# EAGLE design Wand Battery Board Rev 1 (EAGLE 9.7.0)
Assembly variants: AA-Batteries
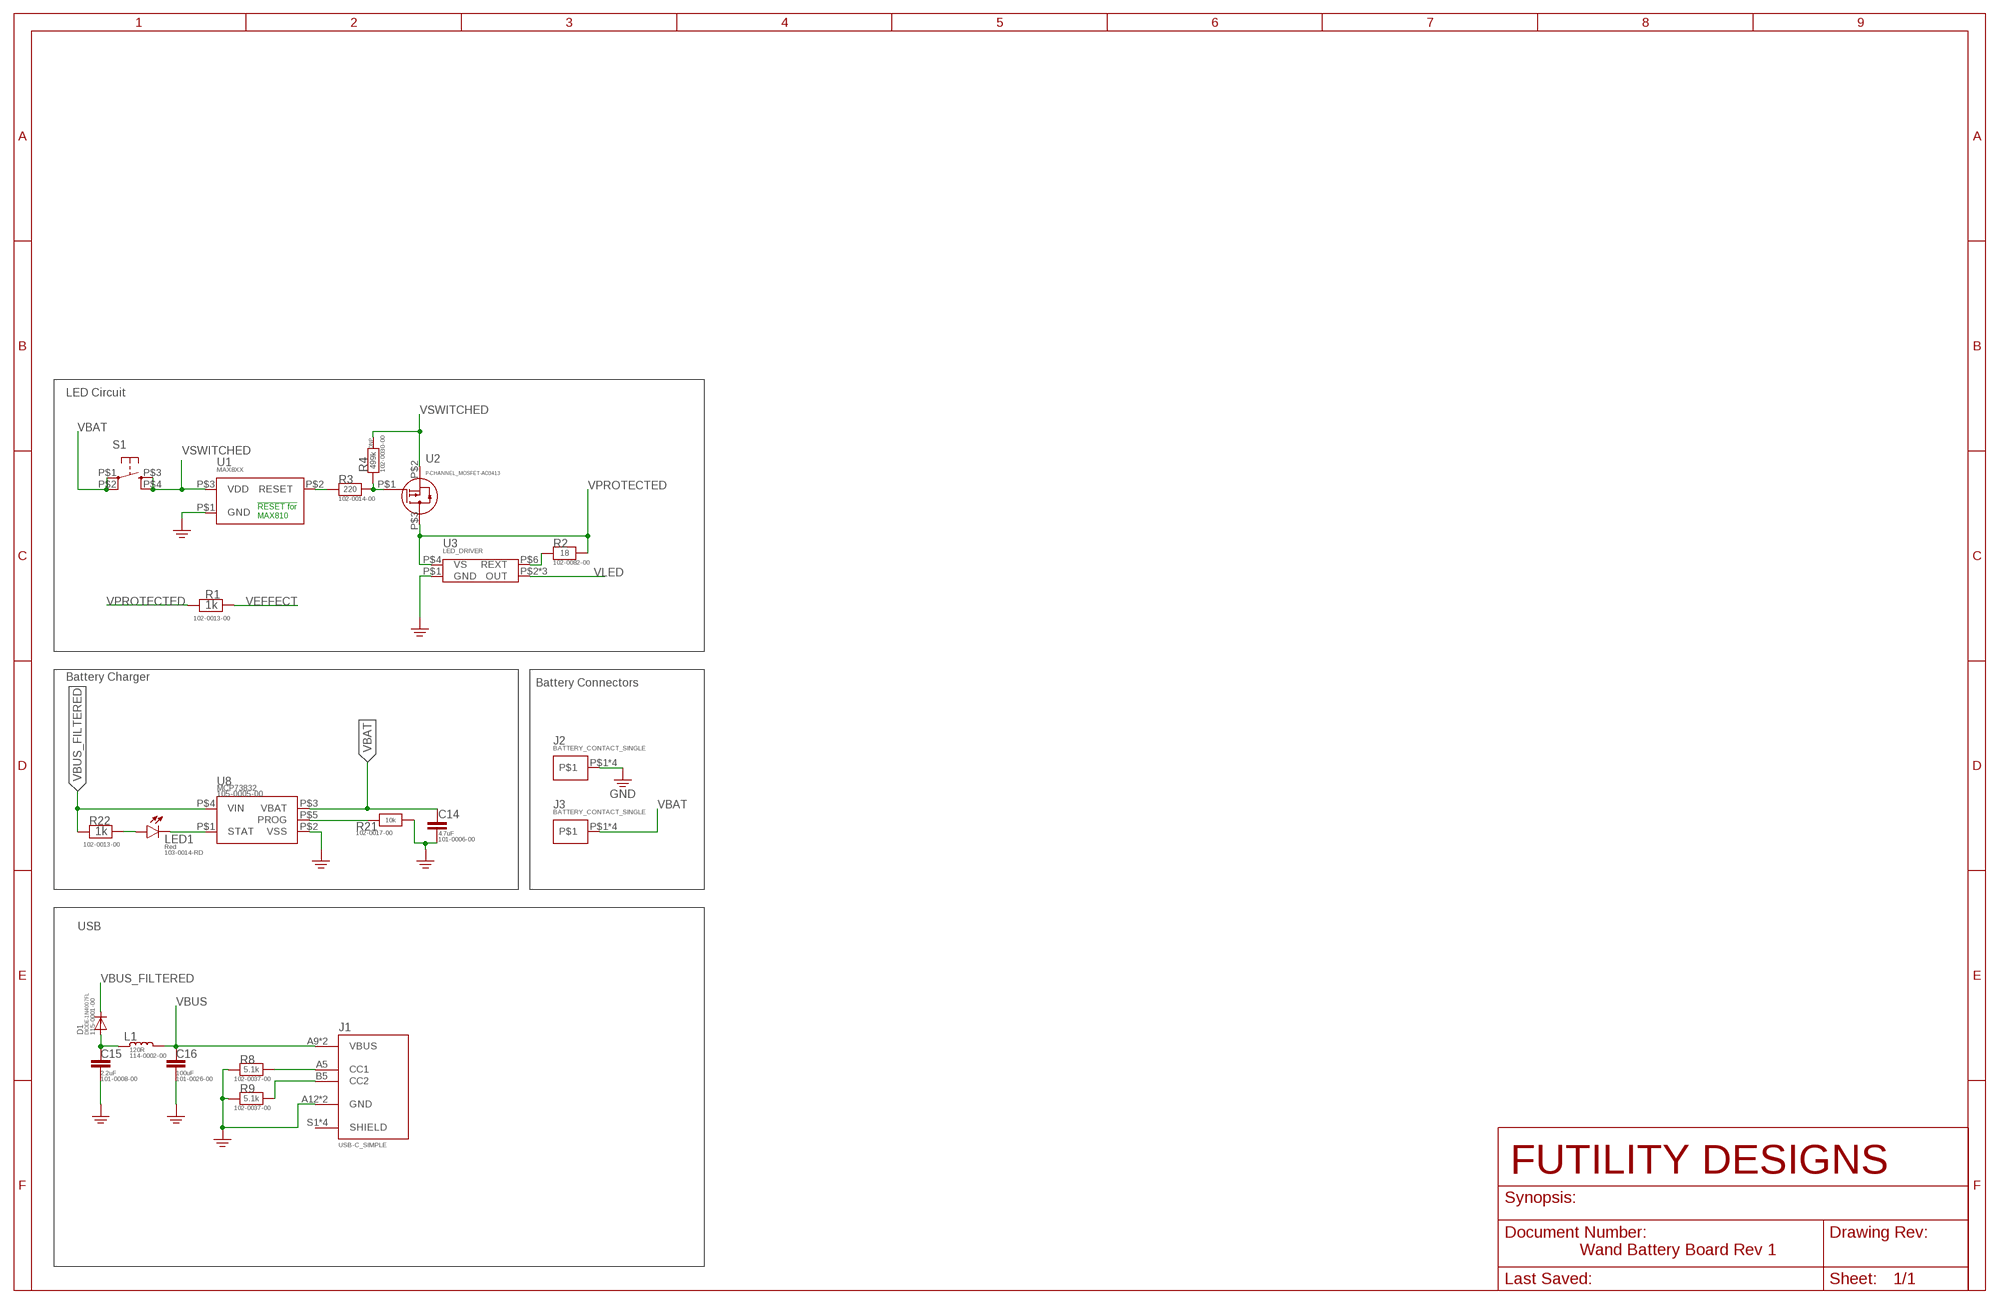
[diagram p0: schematic, sheet 1]

## Parts
C14  4.7uF  CAPACITOR-SMD-0402  [0402]
C15  2.2uF  CAPACITOR-SMD-0603  [0603]
C16  100uF  CAPACITOR-SMD-1210  [1210]
D1  DIODE-1N4007FL  [SOD-123FL]
J1  USB-C_SIMPLE  [GCT_USB4125-GF-A_REVA2]
J2  BATTERY_CONTACT_SINGLE  [BH-129A-5]
J3  BATTERY_CONTACT_SINGLE  [BH-129A-5]
L1  120R  INDUCTOR0603  [0603]
LED1  Red  LED-RA_0603  [IN-S63AS]
R1  1k  RESISTOR-SMD0402  [0402]
R2  18  RESISTOR-SMD0402  [0402]
R3  220  RESISTOR-SMD0402  [0402]
R4  499k  RESISTOR-SMD0402  [0402]
R8  5.1k  RESISTOR-SMD0402  [0402]
R9  5.1k  RESISTOR-SMD0402  [0402]
R21  10k  RESISTOR-SMD0402  [0402]
R22  1k  RESISTOR-SMD0402  [0402]
S1  BUTTON_MOM-6X6X4.3SMD  [6X6X4.3_SMD]
U1  MAX8XX  [SOT23]
U2  P-CHANNEL_MOSFET-AO3413  [SOT23]
U3  LED_DRIVER  [SOT26]
U8  MCP73832  [MCP73832]

## Nets
GND: C14.P$2 C15.P$2 C16.P$2 J1.A12(GND) J1.B12(GND) J2.P$1 J2.P$2 J2.P$3 J2.P$4 R8.P$2 R9.P$2 R21.P$2 U1.P$1(GND) U3.P$1(GND) U8.P$2(VSS)
N$1: J1.A5(CC1) R8.P$1
N$2: R2.P$1 U3.P$6(REXT)
N$3: R3.P$1 U1.P$2(RESET)
N$4: R3.P$2 R4.P$1 U2.P$1(G)
N$5: J1.B5(CC2) R9.P$1
N$10: C15.P$1 D1.P$2(ANODE) L1.P$1
N$16: LED1.P$1(C) U8.P$1(STAT)
N$18: LED1.P$2(A) R22.P$2
N$22: R21.P$1 U8.P$5(PROG)
VBAT: C14.P$1 J3.P$1 J3.P$2 J3.P$3 J3.P$4 S1.P$1(P) S1.P$2(P1) U8.P$3(VBAT)
VBUS: C16.P$1 J1.A9(VBUS) J1.B9(VBUS) L1.P$2
VBUS_FILTERED: D1.P$1(CATHODE) R22.P$1 U8.P$4(VIN)
VEFFECT: R1.P$2
VLED: U3.P$2(OUT) U3.P$3(OUT) U3.P$5(OUT)
VPROTECTED: R1.P$1 R2.P$2 U2.P$3(D) U3.P$4(VS)
VSWITCHED: R4.P$2 S1.P$3(S) S1.P$4(S1) U1.P$3(VDD) U2.P$2(S)
Unconnected: J1.S1(SHIELD) J1.S2(SHIELD) J1.S3(SHIELD) J1.S4(SHIELD)

## Notes on the sheet
- LED Circuit
- Battery Charger
- Battery Connectors
- USB

## Library data of the parts
C14 = 1-chris-parts:CAPACITOR-SMD; PART_NUMBER: 101-0006-00
C15 = 1-chris-parts:CAPACITOR-SMD; PART_NUMBER: 101-0008-00
C16 = 1-chris-parts:CAPACITOR-SMD; PART_NUMBER: 101-0026-00
D1 = 1-chris-parts:DIODE; PART_NUMBER: 115-0001-00
J1 = 1-chris-parts:USB-C_SIMPLE
J2 J3 = 1-Chris-Power:BATTERY_CONTACT_SINGLE
L1 = 1-chris-parts:INDUCTOR: Inductors 0603: 10nH Ceramic Inductor - microwire antenna/RF (Digikey: 712-1434-2-ND) 0805: 560nH Ceramic Inductor - RF (Digikey: 553-1047-1-ND) 270nH Ceramic Inductor - Q = 40@250MHz, +-5%, 1 Ohm DC Resistance (Digikey: 535-10506-2-ND) 1007 (2518 Metric) SMT: 10µH 10% 250mOhm 820mA 1007 Inductor (Digikey: 587-2189-1-ND) 22µH 10% 500mOhm 580mA 1007 Inductor (Digikey: 587-2190-1-ND) 47µH 10% 950mOhm 420mA 1007 Inductor (Digikey: 587-2191-1-ND) 47µH 5% 100mOhm 1A 1008 Inductor (Digikey: 732-1816-1-ND) 5.0x5.0mm (Taiyo Yuden NR5040 Series) 6.8µH 20% 2.3A 64mOhm Inductor (Digikey: 587-2374-2-ND) 5.0x5.0mm (TDK VLC5045 Series) 4.7µH 20% 3.3A 34mOhm Inductor (Digikey: 445-6526-1-ND) 6.8µH 20% 2.7A 46mOhm Inductor (Digikey: 445-6527-1-ND) 6.0x6.0mm (TDK VLC6045 Series) 4.7µH 20% 3.8A 27mOhm Inductor (Digikey: 445-6538-2-ND) 6.8µH 20% 3A 41mOhm Inductor (Digikey: 445-6540-1-ND) 6.2µH 30% 2.2A 45mOhm Inductor (Digikey: SRR5028-6R2YCT-ND) - Not TDK VLC6045 but footprint should match 6.0x6.0mm (TDK SLF6045 Series) 6.8uH 30% 2A 33mOhm Inductor (Digikey: 445-4572-1-ND, Mouser: 810-SLF645T6R8N2R0PF) 6.0x6.0mm (Sumida CDRH5D28 Series) 6.2uH 30% 1.8A 45mOhm Inductor (Digikey: 308-1542-1-ND) Taiyo Yuden NR3015T2R2M - 2.2uH 20% 1.5A (Digikey: 587-1648-2-ND, Mouser: 963-NR3015T2R2M) - Used with TI TPS62172 CoilCraft RFID Transponder Coil - MA5532-AE (For use with AS3935 Lightning Sensor) Vishay IHLP 1.0uH Molded Inductor - 24mOhm DCR, 5A, +/-20%, -55°C-125°C (Digikey: 541-1319-1-ND); PART_NUMBER: 114-0002-00
LED1 = 1-chris-parts:LED; PART_NUMBER: 103-0014-RD
R1 R22 = 1-chris-parts:RESISTOR-SMD; PART_NUMBER: 102-0013-00
R2 = 1-chris-parts:RESISTOR-SMD; PART_NUMBER: 102-0082-00
R3 = 1-chris-parts:RESISTOR-SMD; PART_NUMBER: 102-0014-00
R4 = 1-chris-parts:RESISTOR-SMD; DNP: yes; PART_NUMBER: 102-0030-00
R8 R9 = 1-chris-parts:RESISTOR-SMD; PART_NUMBER: 102-0037-00
R21 = 1-chris-parts:RESISTOR-SMD; PART_NUMBER: 102-0017-00
S1 = 1-chris-parts:BUTTON_MOM: OMRON SWITCH
U1 = 1-chris-parts:MAX8XX
U2 = 1-chris-parts:P-CHANNEL_MOSFET
U3 = 1-chris-parts:LED_DRIVER
U8 = 1-chris-parts:MCP73832; PART_NUMBER: 105-0005-00

## Net classes
1 diff pairs: width 0.152 mm

## Board
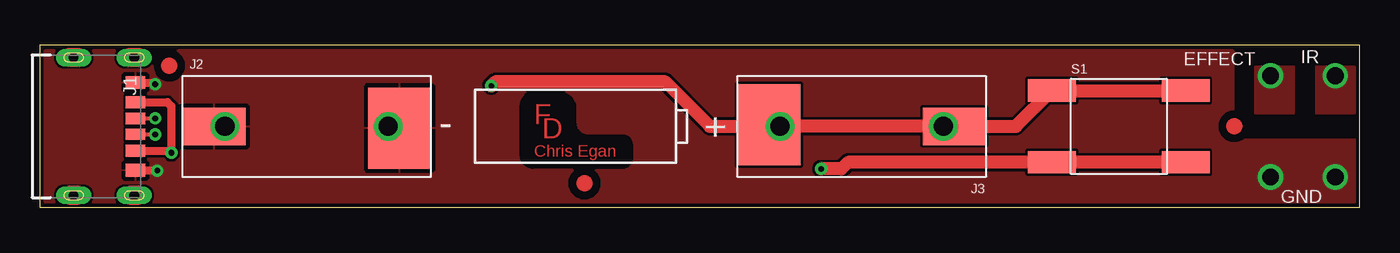
[diagram p1: board, top side]
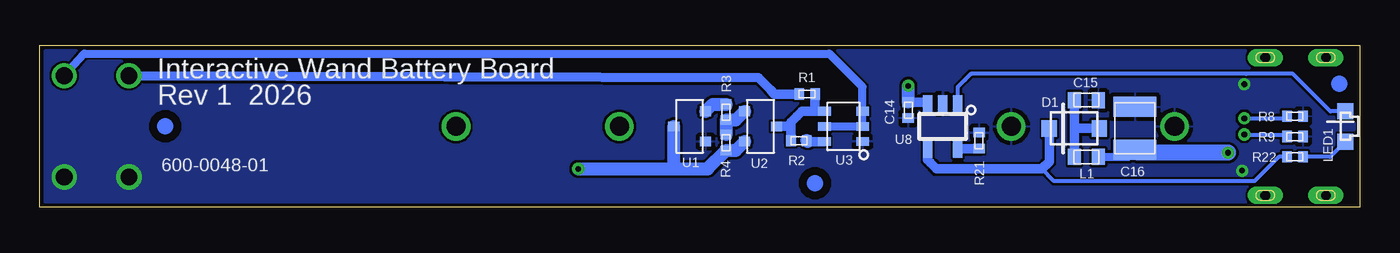
[diagram p2: board, bottom side, seen from below]

Size 82.8 x 10.16 mm. Coordinates in mm from the lower left corner, seen from the top.
Outline: 0,0 82.8,0 82.8,10.16 0,10.16 0,0
Copper layers (1*16): Top / Bottom
Stack-up Default Layer Stack: Top SilkScreen Epoxy Ink / Top SolderMask SR:Green 0.0254mm Dk 4.3 / Top Surface Finish Lead-Free 0.02mm / Top CuFoil:007 0.035mm / Dielectric-1 User Defined 0.9mm / Bottom CuFoil:007 0.035mm / Bottom Surface Finish Lead-Free 0.02mm / Bottom SolderMask SR:Green 0.0254mm Dk 4.3 / Bottom SilkScreen Epoxy Ink
Design rules: minimum copper width classes=1 6mil, minimum copper width 6mil, minimum drill size 0.35mm, copper clearance wire_polygon to wire_polygon 6mil, copper clearance wire_polygon to pad_smd 6mil, copper clearance wire_polygon to via 6mil, copper clearance pad_smd to pad_smd 6mil, copper clearance pad_smd to via 6mil, copper clearance via to via 6mil, copper clearance smd to pad (same net) 6mil, copper clearance smd to via (same net) 6mil, copper clearance smd to smd (same net) 6mil, dimension clearance 10mil, restrict clearance 0mil, via restrict clearance 0mil, drill distance 6mil, keepout clearance 0mil

### Footprints (pad centres in the part's own frame; a part is rotated, then mirrored left to right if it is on the bottom)
0402 = smd 0.7 x 0.6: P$1 0,0.5; P$2 0,-0.5
0603 = smd 1 x 0.8: P$1 0,0.75; P$2 0,-0.75
1210 = smd 2.7 x 1.25: P$1 0,1.35; P$2 0,-1.35
SOD-123FL = smd 0.95 x 1.05: P$1 -1.575,0; P$2 1.575,0
GCT_USB4125-GF-A_REVA2 = smd 0.7 x 1.2: A5 -0.5,3.08; B5 0.5,3.08 | smd 0.76 x 1.2: A9 1.52,3.08; B9 -1.52,3.08 | smd 0.8 x 1.2: A12 2.75,3.08; B12 -2.75,3.08 | drill 0.6 pad 0.8 long: S1 -4.32,3; S2 4.32,3; S3 -4.32,-0.8; S4 4.32,-0.8
BH-129A-5 = smd 3.96 x 2.34: P$1 -0.68,0 | smd 3.96 x 5.08: P$2 10.96,-0.1 | drill 1.2: P$3 0,0; P$4 10.25,0
IN-S63AS = smd 1 x 1: P$1 -0.95,0; P$2 0.95,0
6X6X4.3_SMD = smd 3 x 1.4: P$1 -4.2,2.25; P$2 4.2,2.25; P$3 -4.2,-2.25; P$4 4.2,-2.25
SOT23 = smd 0.6 x 0.7: P$1 -0.95,-1; P$2 0.95,-1; P$3 0,1
SOT26 = smd 0.55 x 0.8: P$1 -0.95,-1.2; P$2 0,-1.2; P$3 0.95,-1.2; P$4 0.95,1.2; P$5 0,1.2; P$6 -0.95,1.2
MCP73832 = smd 0.6 x 1.1: P$1 -0.95,-1.4; P$2 0,-1.4; P$3 0.95,-1.4; P$4 0.95,1.4; P$5 -0.95,1.4

### Placement (x,y rotation side)
C14  28.32,6.1 0 bottom
C15  17.14,6.73 90 bottom
C16  14.1,4.95 180 bottom
D1  17.91,4.95 0 bottom
J1  2.92,5.08 270 top
J2  11.61,5.08 0 top
J3  56.69,5.08 180 top
L1  17.14,3.17 90 bottom
LED1  0.89,5.08 270 bottom
R1  34.67,7.11 270 bottom
R2  35.18,4.19 270 bottom
R3  39.75,5.97 0 bottom
R4  39.75,4.06 0 bottom
R8  4.06,5.71 90 bottom
R9  4.06,4.45 90 bottom
R21  23.88,4.19 180 bottom
R22  4.06,3.17 90 bottom
S1  67.69,5.08 0 top
U1  42.04,5.08 90 bottom
U2  37.59,5.08 270 bottom
U3  32.38,5.08 90 bottom
U8  26.16,5.08 180 bottom
U$1  [FIDUCIAL]  74.93,5.08 0 top
U$2  [FIDUCIAL]  34.16,1.52 0 top
U$3  [FIDUCIAL]  8.13,8.89 0 top
U$4  [FIDUCIAL]  1.27,7.75 180 bottom
U$5  [FIDUCIAL]  34.16,1.52 180 bottom
U$6  [FIDUCIAL]  74.93,5.08 180 bottom
U$7  [LOGO_SMALLER]  30.99,3.17 0 top

### Tracks (layer width: path | path; a pad name or v marks a point on that pad's centre or on a via)
GND  (via drill 0.35, 1.05)
  Top 0.508: J1.A12 7.32,2.33 7.34,2.31 v7.37,2.31 | J1.B12 7.13,7.83 v7.24,7.72
  other vias: 77.22,1.91 81.28,1.91
  pour Top: 82.55,1.27 76.2,1.27 76.2,4.32 82.55,4.32
  pour Bottom (rank 2): -1.65,11.81 84.07,11.81 84.07,-1.4 -1.65,-1.4
  pour Top (rank 2): -2.03,12.19 74.93,12.19 74.93,4.32 83.31,4.32 83.31,-2.67 -2.16,-2.67
N$1  (via drill 0.35)
  Top 0.254: J1.A5 v7.24,5.59
  Bottom 0.254: v7.24,5.59 4.69,5.59 R8.P$1
N$2
  Bottom 0.61: 34.62,4.13 U3.P$6
  Bottom 0.813: R2.P$1 34.62,4.13
N$3
  Bottom 0.813: R3.P$1 40.6,6.47 U1.P$2
N$4
  Bottom 0.813: R4.P$1 R3.P$2 39.15,5.47 U2.P$1
N$5  (via drill 0.35)
  Top 0.254: J1.B5 v7.23,4.58 v7.24,4.57
  Bottom 0.254: v7.24,4.57 4.69,4.57 R9.P$1
N$10
  Bottom 0.61: L1.P$1 17.89,4.95 | 17.89,4.95 C15.P$1 | D1.P$2 17.89,4.95
N$16
  Bottom 0.254: U8.P$1 25.21,7.55 24.77,8 24.38,8.38 7.11,8.38 4.19,8.38 2.92,7.11 1.84,6.03 LED1.P$1
N$18
  Bottom 0.254: LED1.P$2 1.84,3.17 R22.P$2
N$22
  Bottom 0.61: U8.P$5 R21.P$1
VBAT  (via drill 0.35)
  Top 0.813: v28.32,7.62 28.57,7.87 39.24,7.87 42.04,5.08 45.63,5.08 J3.P$2 45.83,5.08 | 45.83,5.08 J3.P$4 | J3.P$1 J3.P$3 | J3.P$1 45.83,5.08 | J3.P$1 61.24,5.08 S1.P$1 S1.P$2
  Bottom 0.61: U8.P$3 27.23,6.6 C14.P$1
  Bottom 0.813: C14.P$1 v28.32,7.62
VBUS  (via drill 0.35)
  Top 0.508: J1.B9 8.01,6.6 8.26,6.35 v8.26,3.43 8.12,3.56 J1.A9
  Bottom 0.508: L1.P$2 14.53,3.17 C16.P$1
  Bottom 1.016: v8.26,3.43 13.92,3.43 C16.P$1
VBUS_FILTERED
  Bottom 0.254: R22.P$1 5.08,3.17 6.48,1.78 6.6,1.65 9.27,1.65 19.18,1.65 19.94,2.41
  Bottom 0.61: D1.P$1 19.48,2.87 19.94,2.41 26.16,2.41 26.54,2.41 26.92,2.79 27.11,2.98 U8.P$4
VEFFECT  (via drill 1.05)
  Bottom 0.61: R1.P$2 36.7,7.11 36.96,7.37 37.72,8.13 v77.22,8.25
  pour Top: 78.74,8.89 78.74,5.84 76.2,5.84 76.2,8.89
VLED  (via drill 1.05)
  Bottom 0.508: U3.P$5 U3.P$2 U3.P$3 31.18,7.56 31.75,8.13 33.27,9.65 80.01,9.65 v81.28,8.25
  pour Top: 80.01,5.84 82.55,5.84 82.55,8.89 80.01,8.89
VPROTECTED
  Bottom 0.61: U2.P$3 35.68,5.08 R2.P$2 35.68,5.34 35.31,5.71 34.99,6.03 34.16,6.03 | U3.P$4 34.16,6.03 | R1.P$1 34.17,6.04 34.16,6.03
VSWITCHED  (via drill 0.35)
  Top 0.813: S1.P$4 S1.P$3 50.71,2.83 50.29,2.41 v49.02,2.41
  Bottom 0.813: v49.02,2.41 43.05,2.41 | 43.05,2.41 40.9,2.41 R4.P$2 39.16,3.56 U2.P$2 | U1.P$3 43.04,2.43 43.05,2.41

### Text on the board
SilkscreenTop: EFFECT | IR | - | + | GND
SilkscreenBottom: Interactive Wand Battery Board | Rev 1 2026 | 600-0048-01